# Altium schematic sheet Top Level.SchDoc
size A
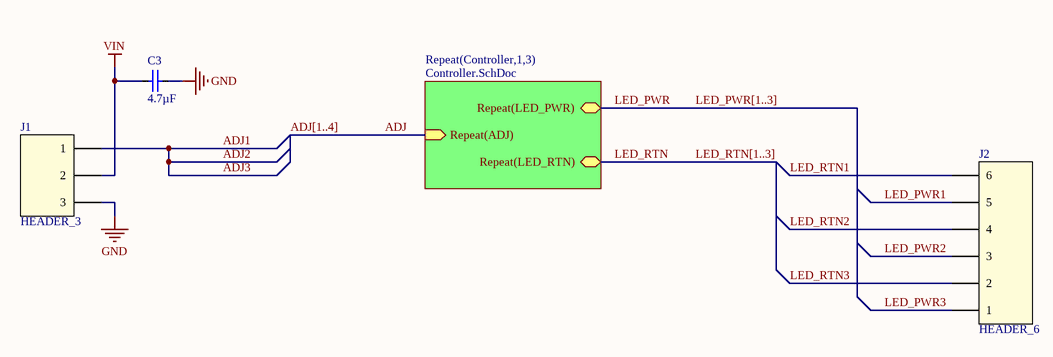
[diagram p0: Top Level.SchDoc]

## Parts
C3  4.7µF  [CAP_1206]
J1  HEADER_3  [MOLEX_C-GRID3_3PIN]
J2  HEADER_6  [MOLEX_C-GRID3_6PIN]

## Sub-sheets
Repeat(Controller,1,3) = Controller.SchDoc: Repeat(ADJ) (in), Repeat(LED_PWR), Repeat(LED_RTN)

## Nets
GND: C3.2 J1.3
VIN: C3.1 J1.2
ADJ: sheet Repeat(Controller,1,3)/Repeat(ADJ)
ADJ1: J1.1  [also labelled ADJ2, ADJ3]
LED_PWR: sheet Repeat(Controller,1,3)/Repeat(LED_PWR)
LED_PWR1: J2.5
LED_PWR2: J2.3
LED_PWR3: J2.1
LED_RTN: sheet Repeat(Controller,1,3)/Repeat(LED_RTN)
LED_RTN1: J2.6
LED_RTN2: J2.4
LED_RTN3: J2.2

## Buses and harness runs
bus ADJ[1..4]
bus LED_PWR[1..3]
bus LED_RTN[1..3]

## Library data of the parts
C3 = CAPACITOR: Manufacturer: TDK Corporation; Manufacturer Part Number: C3216X7R1V475M160AE; Temperature Coefficient: X7R; Voltage - Rated: 35V; Capacitance: 4.7µF; Package / Case: 1206 (3216 Metric); Supplier 1: Digi-Key; Supplier Part Number 1: 445-6813-2-ND; Applications: Boardflex Sensitive; Operating Temperature: -55°C ~ 125°C
J1 = HEADER_3: Supplier 1: Digi-Key; Supplier Part Number 1: WM8204-ND
J2 = HEADER_6: Supplier 1: Digi-Key; Supplier Part Number 1: WM8197-ND